# Altium project SYNCHRONOUS_DC_DC_CONVERTER.PrjPcb
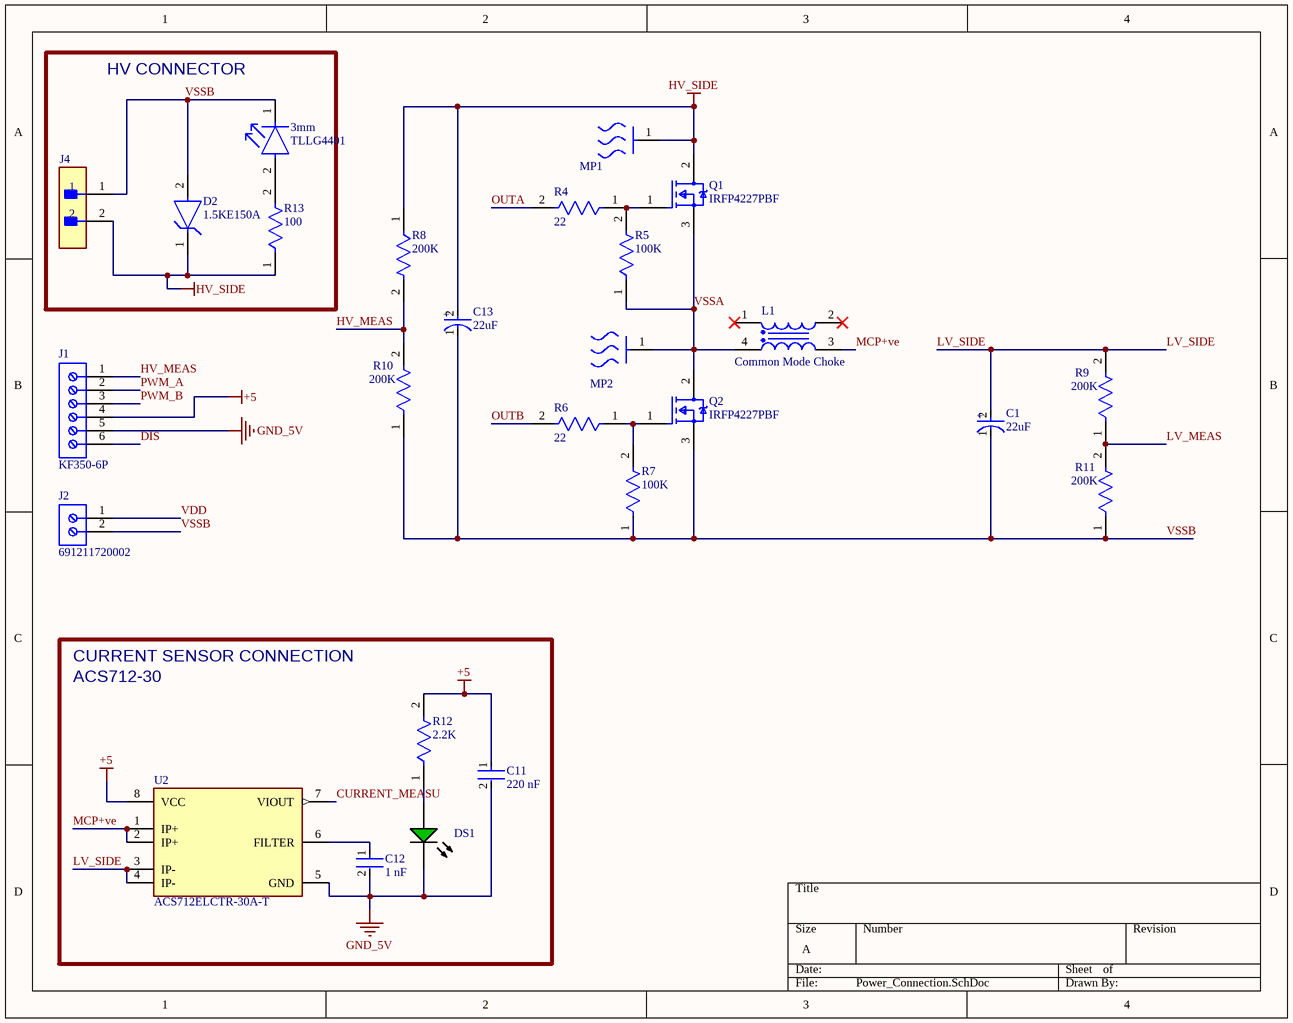
[diagram p0: Power_Connection.SchDoc]
2 sheets, 42 parts. Net scope: global (net labels, ports and power ports of the same name join across sheets).
Board file: DC_DC_CONVERTER.PcbDoc
Sheets:
  Power_Connection.SchDoc
  Gate_Driver_Connection.SchDoc

## Sheet Power_Connection.SchDoc
size A; SheetNumber: 1; SheetTotal: 2

### Parts
3mm  TLLG4401  [FP-6_544-5255_01-4-MFG]
C1  22uF  [FP-RAD-TH-D_12_5_0_5-L_20-MFG]
C11  220 nF  [FP-C0805C-DN-MFG]
C12  1 nF  [FP-C0805C-DN-MFG]
C13  22uF  [FP-RAD-TH-D_12_5_0_5-L_20-MFG]
D2  1.5KE150A  [FP-DO-201-0]
DS1  HSMG-C170  [AVAG-HSMX-C170_V]  (value not drawn)
J1  KF350-6P  [PCBComponent_1]
J2  691211720002  [691211720002]
J4  B2B-XH-A(LF)(SN)  [FP-B2B-XH-A_LF_SN-MFG]  (value not drawn)
L1  Common Mode Choke  [PCBComponent_1]
MP1  532702B02500G  [FP-532702B02500G-MFG]  (value not drawn)
MP2  532702B02500G  [FP-532702B02500G-MFG]  (value not drawn)
Q1  IRFP4227PBF  [FP-PG-TO247-3-MFG]
Q2  IRFP4227PBF  [FP-PG-TO247-3-MFG]
R4  22  [FP-VR37-MFG]
R5  100K  [FP-RC0805-0_6-IPC_C]
R6  22  [FP-VR37-MFG]
R7  100K  [FP-RC0805-0_6-IPC_C]
R8  200K  [FP-CF18-MFG]
R9  200K  [FP-CF18-MFG]
R10  200K  [FP-CF18-MFG]
R11  200K  [FP-CF18-MFG]
R12  2.2K  [FP-RC0805-0_6-IPC_C]
R13  100  [FP-RC0805-0_6-IPC_C]
U2  ACS712ELCTR-30A-T  [FP-LC-8-IPC_C]

### Blocks framed on the sheet
HV CONNECTOR: 3mm D2 J4 R13

### Nets
+5: C11.1 J1.4 R12.2 U2.8(VCC)  [project net VCCI]
GND_5V: C11.2 C12.2 DS1.2(K) J1.5 U2.5(GND)
HV_SIDE: C13.2(A) D2.1(K) J4.2 MP1.1(MNT_1) Q1.2(DRAIN) R8.1 R13.1
CURRENT_MEASU: U2.7(VIOUT)
DIS: J1.6
HV_MEAS: J1.1 R8.2 R10.2
LV_MEAS: R9.1 R11.2
LV_SIDE: C1.2(A) R9.2 U2.3(IP-) U2.4(IP-)
MCP+ve: L1.3 U2.1(IP+) U2.2(IP+)
OUTA: R4.2
OUTB: R6.2
PWM_A: J1.2
PWM_B: J1.3
VDD: J2.1
VSSA: L1.4 MP2.1(MNT_1) Q1.3(SOURCE) Q2.2(DRAIN) R5.1
VSSB: 3mm.1(C) C1.1(C) C13.1(C) D2.2(A) J2.2 J4.1 Q2.3(SOURCE) R7.1 R10.1 R11.1
Net3mm_2: 3mm.2(A) R13.2
NetC12_1: C12.1 U2.6(FILTER)
NetDS1_1: DS1.1(A) R12.1
NetQ1_1: Q1.1(GATE) R4.1 R5.2
NetQ2_1: Q2.1(GATE) R6.1 R7.2

Not connected (* = marked no-connect by the designer): L1 1* 2(4)*

### Notes on the sheet
- CURRENT SENSOR CONNECTION
- ACS712-30
- (in symbol CMP-05427-001477-1) +

### Library data of the parts
3mm = CMP-00030-39390728-1: TLLG4401 LED, Green, 2mcd, 3mmDia., T-1, +/-25deg, 565nm, 7mA, 1.9V Vf, 20V Vr, 20mW, -40; Test Current: 2mA; Wavelength: 575nm; Number of Elements: 1; Viewing Angle: 25°; Lens Transparency: Diffused; Voltage Rating (DC): 2.4V; Lead Length: 23mm; Max Junction Temperature (Tj): 100°C; Lens Style: Circular, Colored, Diffused, Dome, Round, Tinted; Reverse Voltage: 6V; Forward Voltage: 1.9V; Length: 3.2mm; Forward Current: 2mA; Color: Green; Dominant Wavelength: 575nm; Radiation Hardening: No; NexarPartId: 39390728; Lens Color: Green; REACH SVHC: Unknown; Lead Free: Lead Free; Number of Pins: 2; Luminous Intensity: 2mcd; Schedule B: 8541402000, 8541402000; Max Operating Temperature: 100°C; Illumination Color: Green; Mount: Through Hole; Packaging: Bulk; Depth: 3.2mm; Ambient Temperature Range High: 100°C; Case/Package: Radial; Power Dissipation: 20mW; Height: 4.5mm; RoHS: Compliant; Peak Wavelength: 565nm; Min Operating Temperature: -40°C; Number of LEDs: 1
C1 C13 = CMP-05427-001477-1: Aluminum Electrolytic Capacitors (Radial Lead Type) 47uF ±20% 160V; Lead Diameter: 0.6mm; Lead/Base Style: Straight; Life (Hours): 2000Hour; Ripple Current: 220mA; Height - Seated (Max): 0.866inch; Diameter: 12.5mm; Package Quantity: 500; Packaging: Ammo Pack; Lead Pitch: 5mm; Series: NHG; Width: 12.5mm; Height: 20mm; Case/Package: Radial; Radiation Hardening: No; Termination: Radial; Capacitance: 47uF; Min Operating Temperature: -25°C; Voltage Rating: 160V; RoHS Compliant: Yes; Max Operating Temperature: 105°C; Voltage Rating (DC): 160V; Length: 20mm; Tolerance: 20%; Mount: Through Hole
C11 C12 = CMP-1036-04552-2: CAP CER 0.22UF 50V X7R 0805; Manufacturer: KEMET; Manufacturer Part Number: C0805C224K5RACTU; Value: 0.22 μF; Temperature Coefficient: 30ppm/°C; Material: Ceramic; Tolerance: 0.1; ComponentLink2URL: https://content.kemet.com/datasheets/KEM_C1003_C0G_SMD.pdf; Temperature Characteristic: X7R; Device Class L3: Ceramic Capacitors; Lead Free: Yes; Temperature: -55°C to +125°C; RoHS: TRUE; Capacitance: 0.22 μF; Automotive: No; Octopart: https://octopart.com/c0805c224k5ractu-kemet-144670; Temperature Range Low: -55°C; Height: 0.88mm; Device Class L1: Passive Components; Digikey Description: CAP CER 0.22UF 50V X7R 0805; ComponentLink2Description: Datasheet; Mouser Description: CAP CER 0.22UF 50V X7R 0805; Category: Cap; Ipc Land Pattern Name: CAPC200125X78; Temperature Range High: +125°C; Package: C0805C-DN; Device Class L2: Capacitors; Voltage Rating: 50 V
D2 = CMP-12225-000015-1: TVS DIODE 28.2V 59V DO201; Manufacturer: STMicroelectronics; Manufacturer Part Number: 1.5KE33A; Breakdown Voltage: 31.4V; Peak Pulse Current: 33A; Peak Pulse Power: 1500W; Clamping Voltage: 45.7V; Direction: Unidirectional; Capacitance: 2700pF; Number Of Channels: 1; Max Junction Temp: +175°C; Value: 2700pF; Device Class L1: Circuit Protection; Ipc Land Pattern Name: DIOPA1650W125L950D530; Automotive: No; Digikey Description: TVS DIODE 28.2V 59V DO201; Reverse Standoff Voltage: 28.2V; Category: Diode; Lead Free: Yes; Temperature: to +175°C; Device Class L3: unset; ComponentLink2URL: https://www.st.com/resource/en/datasheet/1-5ke.pdf; Octopart: https://octopart.com/1.5ke33a-stmicroelectronics-345963; Temperature Range High: +175°C; ComponentLink2Description: Datasheet; Package: DO-201; Height: 5.3mm; Device Class L2: TVS Diodes; RoHS: TRUE
DS1 = CMP-2000-05062-1: Chip LED, Green, 2.2 V, -40 to 85 degC, 2-Pin SMD, Pb-Free, Tape and Reel; Manufacturer: Avago; No. of Pins: 2; Peak Wavelength: 570nm; SVHC: NoSVHC(16-Jun-2014); Dominant Wavelength: 572nm; Forward Current If: 20mA; Viewing Angle: 170deg; Lens Shape: Rectangular; PIV Max: 5V; External Width: 1.25mm; LED Type: Standard; External Depth: 0.8mm; Opto Mounting Orientation: Top; Luminous Intensity: 15mcd; Luminous Intensity Min: 4mcd; Forward Voltage VF Max: 2.6V; External Length / Height: 2mm; Bulb Size: 1.25mmx1.4mm; Light Area Height: 1mm; Voltage Vf Typ: 2.2V; Operating Temperature Max: 85degC; Datasheet Version: Oct-08; MSL: MSL2A-4weeks; Peak Forward Current: 20mA; Package Description: 2-Pin Surface Mount Device, Body 2 x 1.25 mm, Height 0.8 mm; Datasheet URL: https://datasheet.ciiva.com/29280/180495-da-01-en-chip-led-hsmg-c170-gelb-gruen-29280971.pdf; Storage Temperature Min: -40degC; LED Colour: Green; Wavelength Typ: 570nm; Mounting Type: SMD; Forward Current If Max: 20mA; Dominant Wavelength Typ: 572nm; LED Mounting: SMD; Operating Temperature Range: -30degCto+85degC; Operating Temperature Min: -30degC; Manufacturer URL: http://www.avagotech.com/; Packaging: CutTape; Luminous Intensity Typ: 15mcd; Package Reference: HSMX-C170; Storage Temperature Max: 85degC; Opto Case Style: SMD; Forward Voltage: 2.2V
J2 = CMP-1502-02524-2: NexarPartId: 8917714; Number of Positions Per Level: 2; Wire Gauge (Min): 12AWG; Voltage: 300V; Connector Type: PCB, Terminal Block; Pitch: 5.0038mm; Current: 10A; Number of Levels: 1; Wire Gauge (Max): 24AWG; Plating: Brass, Steel; Stripping Length: -7mm; Width: 10mm; Min Operating Temperature: -40°C; Mount: Through Hole; Lead Pitch: 5mm; Max Operating Temperature: 105°C; Packaging: Box; Number of Contacts: 2; Length: 13.7mm; Height: 15.5mm; Color: Green; Number of Pins: 2; Wire/Cable Gauge: 12AWG; Housing Material: Nylon; REACH SVHC: Unknown; Contact Plating: Tin; RoHS: Compliant; Contact Material: Brass; Termination: Screw
J4 = CMP-2000-05888-3: CONN HEADER VERT 2POS 2.5MM; Current Rating: 3A; Voltage Rating: 250V; Number of Contacts: 2; Contact Resistance: 20mR; Wire/Cable Gauge: 22AWG; Insulation Resistance: 1GR; Connector Type: Male Pin; Packaging: Bulk; Contact Material: Brass; Lead Free: Lead Free; Orientation: Straight; Contact Plating: Tin; Max Current Rating: 3A; Termination: Solder; Fastening Type: Detent; Depth: 5.75mm; Housing Material: Polyamide; REACH SVHC: No SVHC; Series: XH; Voltage Rating (AC): 250V; Number of Positions: 2; Color: Natural; Contact Type: Male Pin; Max Voltage Rating (DC): 250V; Pitch: 2.5mm; Lead Pitch: 2.5mm; Mount: Through Hole; Max Operating Temperature: 85°C; Length: 7.4mm; Max Voltage Rating (AC): 250V; Min Operating Temperature: -25°C; Number of Rows: 1; Housing Color: White
L1 = T60405-R6123-X425: Datasheet: https://eu.mouser.com/datasheet/2/599/6123-X425-240794.pdf
MP1 MP2 = CMP-69313-000011-1: HEATSINK TO-220 SOLDERPIN 50.8MM; Natural Thermal Resistance: 4.8°C/W; Finish: Anodized; Shape: Fins; Thermal Resistance @ Forced Air Flow (100 LFM): 2°C/W; Type: Passive; Lead Free: Lead Free; Material: Aluminium; RoHS Compliant: Yes; Case/Package: Radial; Height Off Base: 1inch; Radiation Hardening: No; Color: Black; Height: 50.8mm; Package Quantity: 250; Mount: Bolt; Depth: 25.4mm; Width: 1.65inch; Package Cooled: TO-220; Length: 41.91mm
Q1 Q2 = CMP-32901-000878-1: MOSFET N-CH 200V 65A TO247AC; Rds On Max: 25mR; Element Configuration: Single; Turn-On Delay Time: 33ns; Threshold Voltage: 5V; Input Capacitance: 4.6nF; Max Power Dissipation: 330W; Gate to Source Voltage (Vgs): 30V; Lead Free: Lead Free; Packaging: Rail/Tube; Case/Package: TO-247; Series: HEXFET®; Length: 0.625inch; Max Operating Temperature: 175°C; REACH SVHC: No SVHC; Contact Plating: Tin; RoHS Compliant: Yes; Continuous Drain Current (ID): 65A; Drain to Source Voltage (Vdss): 200V; Height: 0.815inch; Max Dual Supply Voltage: 200V; Halogen Free: Not Halogen Free; Width: 0.209inch; Power Dissipation: 330W; Mount: Through Hole; Number of Pins: 3; Min Operating Temperature: -40°C
R4 R6 = CMP-02408-000054-1: RES 1.2M OHM 5% 1/2W AXIAL; Voltage Rating: 3.5kV; Power Rating: 500mW; Temperature Coefficient: 200ppm/°C; Resistance: 1.2MR; Diameter: 4mm; Max Operating Temperature: 155°C; Military Standard: Not; Reach SVHC Compliant: Yes; Min Operating Temperature: -55°C; Resistance Tolerance: 5%; Resistor Type: Metal Film; Tolerance: 5%; Mount: Through Hole; Construction: Cylindrical; Contact Plating: Tin; Length: 10mm; Termination: Axial; Voltage Rating (DC): 3.5kV; Packaging: Ammo Pack; Radiation Hardening: No; Case/Package: Conformal
R5 R7 R12 R13 = CMP-2100-03668-5: RES 100K OHM 1% 1/8W 0805; Power Rating: 125mW; Temperature Coefficient: 100ppm/°C; Voltage Rating (DC): 150V; Resistance: 100kR; Package Quantity: 1; Case/Package: 0805; Lead Pitch: 0.4mm; Case Code (Imperial): 0805; Construction: Rectangular; Number of Terminations: 2; RoHS Compliant: Yes; Max Power Dissipation: 125mW; Tolerance: 1%; Max Operating Temperature: 155°C; Resistance Tolerance: 1%; Lead Free: Lead Free; Packaging: Tape and Reel; Resistor Type: Thick Film; Min Operating Temperature: -55°C; Case Code (Metric): 2012; Series: RC; Technology: THICK FILM; Voltage Rating: 150V; Termination: SMD/SMT; Width: 0.049inch; Number of Pins: 2; Features: Moisture Resistant; Military Standard: Not; Length: 0.079inch; Depth: 1.25mm; Size Code: 0805; Height: 0.024inch
R8-R11 = CMP-26528-000002-1: RES 10K OHM 1/8W 5% CF AXIAL; Manufacturer Part Number: CF18JT10K0; Manufacturer: Stackpole Electronics; Power Rating: 0.125W; Temperature Coefficient: 0-500ppm/°C; Resistance: 10kΩ; Voltage Rating: 250V; Value: 10kΩ; Temperature: -55°C to +155°C; Height: 2mm; Lead Free: Yes; Automotive: No; Device Class L2: Resistors; Package: CF18; Series: CF; ComponentLink2Description: Datasheet; Ipc Land Pattern Name: RESAD656W65L360D200; Temperature Range High: +155°C; RoHS: TRUE; Device Class L3: Through-Hole Resistors; Temperature Range Low: -55°C; Device Class L1: Passive Components; Category: Res; Octopart: https://octopart.com/cf18jt10k0-stackpole+electronics-19205642; Composition: Carbon Film; Digikey Description: RES 10K OHM 1/8W 5% CF AXIAL; ComponentLink2URL: http://www.seielect.com/Catalog/SEI-CF_CFM.pdf; Tolerance: 5%
U2 = CMP-2000-04990-2: SENSOR CURRENT HALL 30A AC/DC; Bandwidth: 80kHz; Max Supply Current: 13mA; Linearity: 1.5%; Operating Supply Voltage: 5V; Quiescent Current: 10mA; Number of Channels: 1; Polarity: Bidirectional; Min Supply Voltage: 4.5V; Response Time: 5us; Sensitivity: 66mV/A; Max Supply Voltage: 5.5V; Current Sensing: 30A; REACH SVHC: No SVHC; Mount: Surface Mount; Max Operating Temperature: 85°C; Packaging: Cut Tape; Frequency: 80kHz; Series: -; Termination: SMD/SMT; RoHS Compliant: Yes; Number of Pins: 8; Package Quantity: 1; Accuracy: 1.5%; Lead Free: Lead Free; Case/Package: SOIC; Min Operating Temperature: -40°C; Output Current: 10mA

## Sheet Gate_Driver_Connection.SchDoc
size A; SheetNumber: 2; SheetTotal: 2
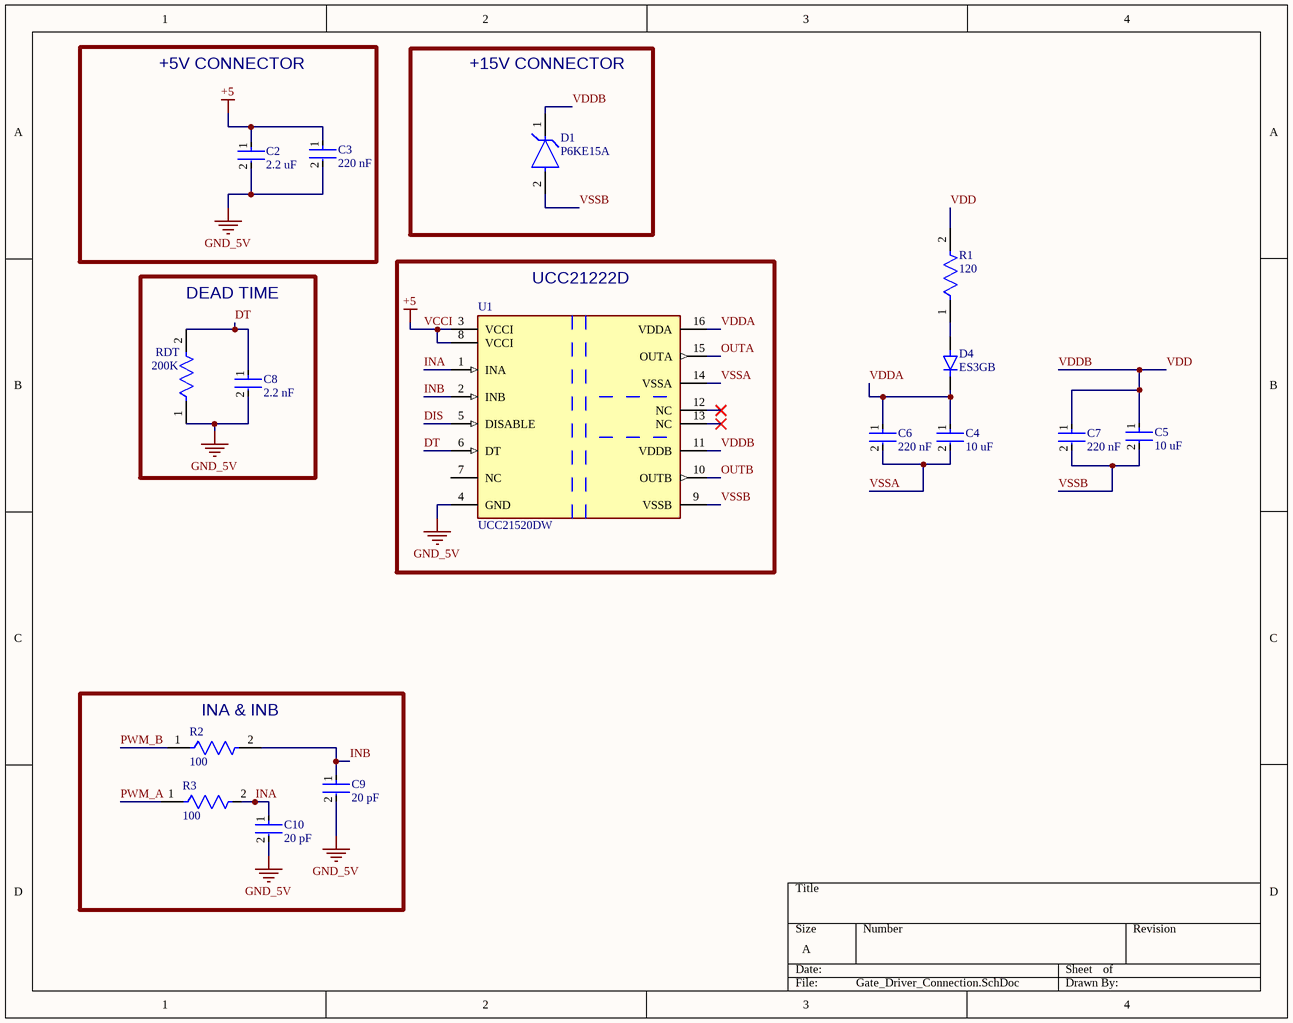
[diagram p1: Gate_Driver_Connection.SchDoc]

### Parts
C2  2.2 uF  [FP-C0805C-DN-MFG]
C3  220 nF  [FP-C0805C-DN-MFG]
C4  10 uF  [FP-C0805C-DN-MFG]
C5  10 uF  [FP-C0805C-DN-MFG]
C6  220 nF  [FP-C0805C-DN-MFG]
C7  220 nF  [FP-C0805C-DN-MFG]
C8  2.2 nF  [FP-C0805C-DN-MFG]
C9  20 pF  [FP-C0805C-DN-MFG]
C10  20 pF  [FP-C0805C-DN-MFG]
D1  P6KE15A  [FP-DO-15-MFG]
D4  ES3GB  [DIOM4336X265N]
R1  120  [FP-RC0805-0_6-IPC_C]
R2  100  [FP-RC0805-0_6-IPC_C]
R3  100  [FP-RC0805-0_6-IPC_C]
RDT  200K  [FP-CF18-MFG]
U1  UCC21520DW  [FP-DW0016B-MFG]

### Blocks framed on the sheet
+5V CONNECTOR: C2 C3
+15V CONNECTOR: D1
DEAD TIME: C8 RDT
UCC21222D: U1
INA & INB: C9 C10 R2 R3

### Nets
GND_5V: C2.2 C3.2 C8.2 C9.2 C10.2 RDT.1 U1.4(GND)
VCCI: C2.1 C3.1 U1.3(VCCI) U1.8(VCCI)  [also labelled +5]
DIS: U1.5(DISABLE)
DT: C8.1 RDT.2 U1.6(DT)
INA: C10.1 R3.2 U1.1(INA)
INB: C9.1 R2.2 U1.2(INB)
OUTA: U1.15(OUTA)
OUTB: U1.10(OUTB)
PWM_A: R3.1
PWM_B: R2.1
VDD: C5.1 C7.1 D1.1(C) R1.2 U1.11(VDDB)  [also labelled VDDB]
VDDA: C4.1 C6.1 D4.C(K) U1.16(VDDA)
VSSA: C4.2 C6.2 U1.14(VSSA)
VSSB: C5.2 C7.2 D1.2(A) U1.9(VSSB)
NetD4_A: D4.A R1.1

Not connected (* = marked no-connect by the designer): U1 7(NC) 12(NC)* 13(NC)*

### Library data of the parts
C2-C10 = CMP-1036-04552-2: as C11 on sheet Power_Connection; ComponentLink2URL: https://content.kemet.com/datasheets/KEM_C1003_C0G_SMD.pdf; Temperature Characteristic: X7R; Device Class L3: Ceramic Capacitors; Lead Free: Yes; Temperature: -55°C to +125°C; RoHS: TRUE; Capacitance: 0.22 μF; Automotive: No; Octopart: https://octopart.com/c0805c224k5ractu-kemet-144670; Temperature Range Low: -55°C; Height: 0.88mm; Device Class L1: Passive Components; Digikey Description: CAP CER 0.22UF 50V X7R 0805; ComponentLink2Description: Datasheet; Mouser Description: CAP CER 0.22UF 50V X7R 0805; Category: Cap; Ipc Land Pattern Name: CAPC200125X78; Temperature Range High: +125°C; Package: C0805C-DN; Device Class L2: Capacitors; Voltage Rating: 50 V
D1 = CMP-00278-00112159-1: P6KE15A 600 Watt SUR40 Transient Voltage Suppressor, 15 V, Unidirectional; NexarPartId: 112159; Element Configuration: Single; Number of Channels: 1; Power Rating: 600W; Power Line Protection: No; Max Surge Current: 28A; Clamping Voltage: 21.2V; Capacitance: 1.6pF; Max Breakdown Voltage: 15.8V; Breakdown Voltage: 14.3V; Reverse Standoff Voltage: 12.8V; Voltage Rating (DC): 15V; Leakage Current: 5µA; Test Current: 1mA; Max Operating Temperature: 150°C; Packaging: Bulk; Case/Package: DO-15; Mount: Through Hole; Number of Elements: 1; Max Power Dissipation: 600W; Radiation Hardening: No; Diameter: 3.56mm; Peak Pulse Current: 28A; Peak Pulse Power: 600W; Length: 6.75mm; Lead Free: Lead Free; Min Operating Temperature: -55°C; Polarity: Unidirectional; Composition: Zener; Current Rating: 28A; Termination: Axial; ESD Protection: No; Height: 3.56mm; REACH SVHC: No SVHC; Weight: 300mg; RoHS: Compliant; Number of Unidirectional Channels: 1; Number of Pins: 2; Operating Supply Voltage: 12.8V; Min Breakdown Voltage: 14.3V; Direction: Unidirectional; Max Reverse Leakage Current: 5µA; Reverse Breakdown Voltage: 14.3V; Power Dissipation: 600W; Width: 3.56mm
D4 = ES3GB: MF: {'manufacturer': u'Taiwan Semiconductor'}; Package: None; Price: None; Value: *; MP: ES3GB; Availability: Unavailable
R1-R3 = CMP-2100-03668-5: as R5 on sheet Power_Connection; Package Quantity: 1; Case/Package: 0805; Lead Pitch: 0.4mm; Case Code (Imperial): 0805; Construction: Rectangular; Number of Terminations: 2; RoHS Compliant: Yes; Max Power Dissipation: 125mW; Tolerance: 1%; Max Operating Temperature: 155°C; Resistance Tolerance: 1%; Lead Free: Lead Free; Packaging: Tape and Reel; Resistor Type: Thick Film; Min Operating Temperature: -55°C; Case Code (Metric): 2012; Series: RC; Technology: THICK FILM; Voltage Rating: 150V; Termination: SMD/SMT; Width: 0.049inch; Number of Pins: 2; Features: Moisture Resistant; Military Standard: Not; Length: 0.079inch; Depth: 1.25mm; Size Code: 0805; Height: 0.024inch
RDT = CMP-26528-000002-1: as R8 on sheet Power_Connection; Temperature: -55°C to +155°C; Height: 2mm; Lead Free: Yes; Automotive: No; Device Class L2: Resistors; Package: CF18; Series: CF; ComponentLink2Description: Datasheet; Ipc Land Pattern Name: RESAD656W65L360D200; Temperature Range High: +155°C; RoHS: TRUE; Device Class L3: Through-Hole Resistors; Temperature Range Low: -55°C; Device Class L1: Passive Components; Category: Res; Octopart: https://octopart.com/cf18jt10k0-stackpole+electronics-19205642; Composition: Carbon Film; Digikey Description: RES 10K OHM 1/8W 5% CF AXIAL; ComponentLink2URL: http://www.seielect.com/Catalog/SEI-CF_CFM.pdf; Tolerance: 5%
U1 = CMP-04912-000047-1: DGTL ISO 5.7KV GATE DRVR 16SOIC; Number of Channels: 2; Max Output Current: 6A; Min Supply Voltage: 6.5V; Working Voltage: 2.121kV; Max Supply Voltage: 25V; Max Operating Temperature: 125°C; REACH SVHC: No SVHC; Case/Package: SOIC; Min Operating Temperature: -40°C; Number of Pins: 16; Lead Free: Lead Free

## Nets that join several sheets
GND_5V: Power_Connection (5 pins), Gate_Driver_Connection (7 pins)
VCCI: Power_Connection (C11.1 J1.4 R12.2 U2.8), Gate_Driver_Connection (C2.1 C3.1 U1.3 U1.8)
DIS: Power_Connection (J1.6), Gate_Driver_Connection (U1.5)
OUTA: Power_Connection (R4.2), Gate_Driver_Connection (U1.15)
OUTB: Power_Connection (R6.2), Gate_Driver_Connection (U1.10)
PWM_A: Power_Connection (J1.2), Gate_Driver_Connection (R3.1)
PWM_B: Power_Connection (J1.3), Gate_Driver_Connection (R2.1)
VDD: Power_Connection (J2.1), Gate_Driver_Connection (5 pins)
VSSA: Power_Connection (5 pins), Gate_Driver_Connection (C4.2 C6.2 U1.14)
VSSB: Power_Connection (10 pins), Gate_Driver_Connection (C5.2 C7.2 D1.2 U1.9)